# Altium project APC1_EPS.PrjPcb
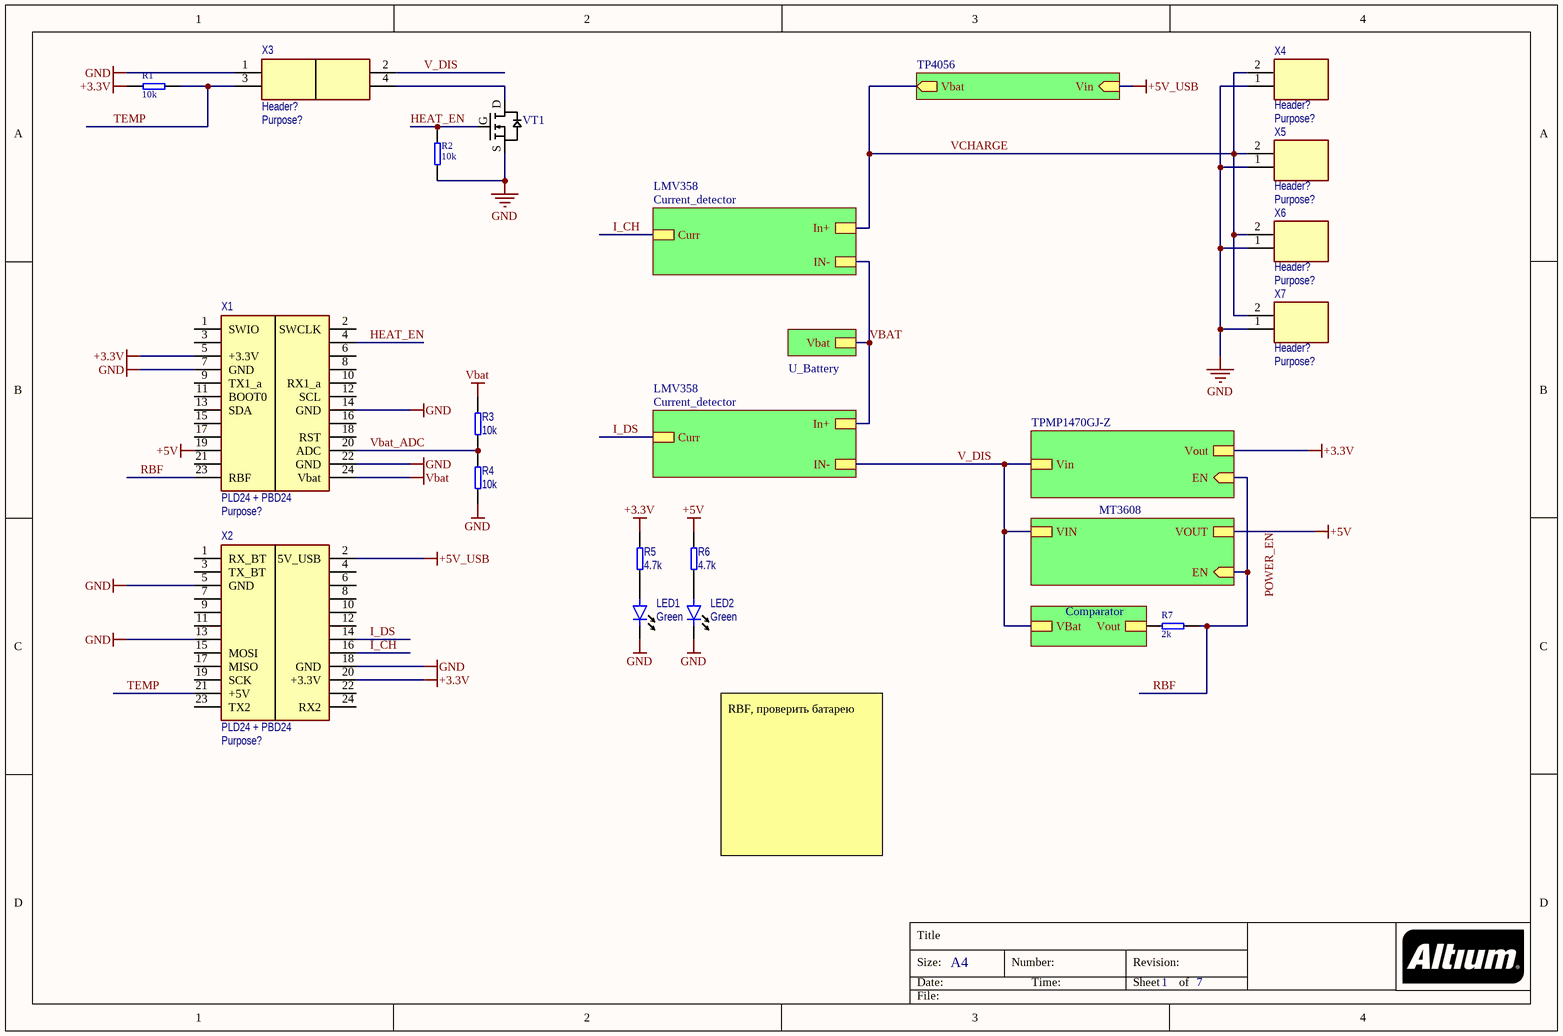
[diagram p0: APC1_EPS.SchDoc]
7 sheets, 73 parts. Net scope: hierarchical (ports join the sheet entries above them; power ports are global).
Board file: APC1_EPS.PcbDoc
Sheets:
  APC1_EPS.SchDoc
    U_Battery = Battery.SchDoc
    TP4056 = TP4056.SchDoc
    TPMP1470GJ-Z = TPMP1470GJ-Z.SchDoc
    Comparator = Comparator.SchDoc
    LMV358 = Current_detector.SchDoc
    LMV358 = Current_detector.SchDoc
    MT3608 = MT3608.SchDoc

## Sheet APC1_EPS.SchDoc: =GlobalProjectName
size A4; ApprovedBy: Утвердил; CheckedBy: Проверил; Author: Разработал; SheetNumber: 1; SheetTotal: 7; PageSetup: Record=PageOptions|CenterHorizontal=True|CenterVertical=True|PrintScale=1.00|XCorrection=1.00|YCorrection=1.00|PrintKind=1|BorderSize=5000000|LeftOffset=0|BottomOffset=0|Orientation=2|PaperLength=1000|PaperWidth=1000|Scale=100|PaperSource=15|PrintQuality=1200|MediaType=1|DitherType=10|PaperKind=A3|PrintScaleMode=1; Weight: -; ScaleFactor: -; NormInspection: Норм.Контр.

### Parts
LED1  value Green  [LED 0603]
LED2  value Green  [LED 0603]
R1  value 10k  [RES 0402]
R2  value 10k  [RES 0402]
R3  value 10k  [RES 0402]
R4  value 10k  [RES 0402]
R5  value 4.7k  [RES 0402]
R6  value 4.7k  [RES 0402]
R7  value 2k  [RES 0402]
VT1  AO3400A  [SOT23-3]  (value not drawn)
X1  PLD24 + PBD24  Purpose: Purpose?  [PICOSAT_CNN]
X2  PLD24 + PBD24  Purpose: Purpose?  [PICOSAT_CNN]
X3  Header?  Purpose: Purpose?  [PBD-4-2.54]
X4  Header?  Purpose: Purpose?  [ZH-2]
X5  Header?  Purpose: Purpose?  [ZH-2]
X6  Header?  Purpose: Purpose?  [ZH-2]
X7  Header?  Purpose: Purpose?  [ZH-2]

### Sub-sheets
Comparator = Comparator.SchDoc: VBat, Vout
LMV358 = Current_detector: In+, IN-, Curr
LMV358 = Current_detector: In+, IN-, Curr
MT3608 = MT3608.SchDoc: VIN, VOUT, EN (in)
TP4056 = TP4056.SchDoc: Vin (in), Vbat (out)
TPMP1470GJ-Z = TPMP1470GJ-Z.SchDoc: Vin, Vout, EN (in)
U_Battery = Battery.SchDoc: Vbat

### Nets
+3.3V: R1.1 R5.2 X1.5(+3.3V) X2.20(+3.3V) ; sheet TPMP1470GJ-Z/Vout
+5V_USB: X2.2(5V_USB) ; sheet TP4056/Vin
GND: LED1.2(Cathode) LED2.2(Cathode) R2.1 R4.1 VT1.S1 X1.7(GND) X1.14(GND) X1.22(GND) X2.5(GND) X2.13 X2.18(GND) X3.1 X4.1 X5.1 X6.1 X7.1
POWER_EN: R6.2 X1.19 ; sheet MT3608/VOUT  [also labelled +5V]
VBAT: R3.2 X1.24(Vbat) ; sheet U_Battery/Vbat, sheet LMV358/In+, sheet LMV358/IN-
HEAT_EN: R2.2 VT1.G2 X1.4
I_CH: X2.16 ; sheet LMV358/Curr
I_DS: X2.14 ; sheet LMV358/Curr
RBF: R7.2 X1.23(RBF) ; sheet TPMP1470GJ-Z/EN, sheet MT3608/EN
TEMP: R1.2 X2.21(+5V) X3.3
V_DIS: X3.2 ; sheet TPMP1470GJ-Z/Vin, sheet Comparator/VBat, sheet LMV358/IN-, sheet MT3608/VIN
Vbat_ADC: R3.1 R4.2 X1.20(ADC)
VCHARGE: X4.2 X5.2 X6.2 X7.2 ; sheet TP4056/Vbat, sheet LMV358/In+
NetLED1_1: LED1.1(Anode) R5.1
NetLED2_1: LED2.1(Anode) R6.1
NetR7_1: R7.1 ; sheet Comparator/Vout
NetVT1_D6: VT1.D6 X3.4

Not connected (* = marked no-connect by the designer): X1 1(SWIO) 2(SWCLK) 3 6 8 9(TX1_a) 10(RX1_a) 11(BOOT0) 12(SCL) 13(SDA) 15 16 17 18(RST) 21; X2 1(RX_BT) 3(TX_BT) 4 6 7 8 9 10 11 12 15(MOSI) 17(MISO) 19(SCK) 22 23(TX2) 24(RX2)

### Notes on the sheet
- RBF, проверить батарею
- Title
- Size:
- Date:
- A4
- Number:
- Time:
- Revision:
- Sheet
- of
- File:
- (in symbol !Generic N MOSFET) D; G; S

### Library data of the parts
LED1 LED2 = LED: Light Emittering Diode; IsSMT: NoSMT
R1-R7 = !Resistor: Resistor; IsSMT: NoSMT
VT1 = !Generic N MOSFET: generic N mosfet; pin to pad: D6>3 G2>1 S1>2; IsSMT: NoSMT
X1 X2 = Header 2x12: 10x2 header; IsSMT: NoSMT
X3 = Header 2x2: 2x2 header; IsSMT: NoSMT
X4-X7 = Header 1x2: 2x1 header; isSMT: NoSMT

## Sheet Battery.SchDoc: =GlobalProjectName
size 209 x 297 mm; ApprovedBy: Утвердил; CheckedBy: Проверил; Author: Разработал; SheetNumber: 2; SheetTotal: 7; PageSetup: Record=PageOptions|CenterHorizontal=True|CenterVertical=True|PrintScale=1.00|XCorrection=1.00|YCorrection=1.00|PrintKind=1|BorderSize=5000000|LeftOffset=0|BottomOffset=0|Orientation=2|PaperLength=1000|PaperWidth=1000|Scale=100|PaperSource=15|PrintQuality=1200|MediaType=1|DitherType=10|PaperKind=A3|PrintScaleMode=1; Weight: -; ScaleFactor: -; NormInspection: Норм.Контр.
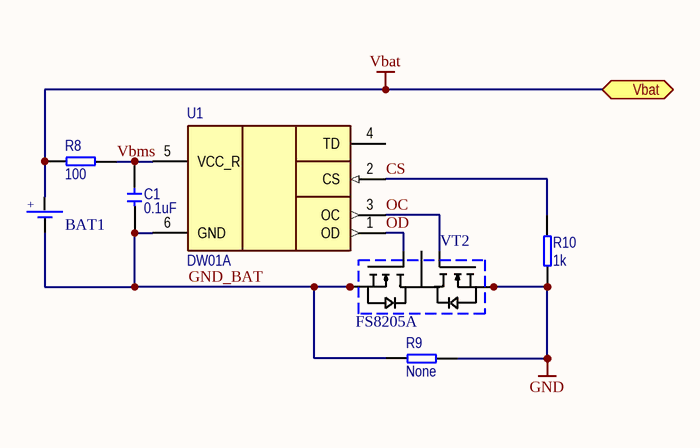
[diagram p1: Battery.SchDoc]

### Parts
BAT1  18350+clipses  [BAT_18350_CLIPS]  (value not drawn)
C1  value 0.1uF  [CERCAP 0402]
R8  value 100  [RES 0402]
R9  value None  [RES 0603]  (no BOM)
R10  value 1k  [RES 0402]
U1  DW01A  [SOT23-6]
VT2  FS8205A  [TSSOP-8]

### Ports
Vbat (bidir)

### Nets
GND: R9.1 R10.1 VT2.6 VT2.7
VBAT: BAT1.A R8.1 ; port Vbat
CS: R10.2 U1.2(CS)
GND_BAT: BAT1.K C1.1 R9.2 U1.6(GND) VT2.2 VT2.3
OC: U1.3(OC) VT2.5
OD: U1.1(OD) VT2.4
Vbms: C1.2 R8.2 U1.5(VCC_R)
NetVT2_1: VT2.1 VT2.8

Not connected (* = marked no-connect by the designer): U1 4(TD)

### Notes on the sheet
- Подп. и дата
- Инв. № дубл.
- Взам. инв. №
- Инв. № подл.
- Изм.
- Лист
- № докум.
- Подп.
- Дата
- Форма 2а ГОСТ 2.104-2006
- Копировал
- Формат А4
- (in symbol !Battery) +

### Library data of the parts
BAT1 = !Battery: generic battery
C1 = !Capacitor: Capacitor; IsSMT: NoSMT; Voltage: 10V; Diel: X7R
R8-R10 = !Resistor: Resistor; IsSMT: NoSMT
U1 = DW01A: BMS
VT2 = FS8205A: double N-ch; IsSMT: NoSMT

## Sheet TP4056.SchDoc: =GlobalProjectName
size 209 x 297 mm; ApprovedBy: Утвердил; CheckedBy: Проверил; Author: Разработал; SheetNumber: 3; SheetTotal: 7; PageSetup: Record=PageOptions|CenterHorizontal=True|CenterVertical=True|PrintScale=1.00|XCorrection=1.00|YCorrection=1.00|PrintKind=1|BorderSize=5000000|LeftOffset=0|BottomOffset=0|Orientation=2|PaperLength=1000|PaperWidth=1000|Scale=100|PaperSource=15|PrintQuality=1200|MediaType=1|DitherType=10|PaperKind=A3|PrintScaleMode=1; Weight: -; ScaleFactor: -; NormInspection: Норм.Контр.
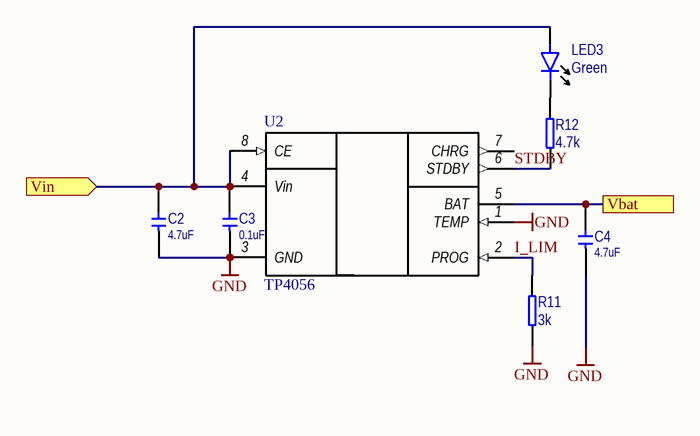
[diagram p2: TP4056.SchDoc]

### Parts
C2  value 4.7uF  [CERCAP 0805]
C3  value 0.1uF  [CERCAP 0402]
C4  value 4.7uF  [CERCAP 0805]
LED3  value Green  [LED 0603]
R11  value 3k  [RES 0402]
R12  value 4.7k  [RES 0402]
U2  TP4056  [SO-8]

### Ports
Vbat, Vin (in)

### Nets
+5V_USB: C2.2 C3.2 LED3.1(Anode) U2.4(Vin) U2.8(CE) ; port Vin
GND: C2.1 C3.1 C4.1 R11.1 U2.1(TEMP) U2.3(GND)
I_LIM: R11.2 U2.2(PROG)
STDBY: R12.1 U2.6(STDBY)
VCHARGE: C4.2 U2.5(BAT) ; port Vbat
NetLED3_2: LED3.2(Cathode) R12.2

Not connected (* = marked no-connect by the designer): U2 7(CHRG)

### Notes on the sheet
- Подп. и дата
- Инв. № дубл.
- Взам. инв. №
- Инв. № подл.
- Изм.
- Лист
- № докум.
- Подп.
- Дата
- Форма 2а ГОСТ 2.104-2006
- Копировал
- Формат А4

### Library data of the parts
C2-C4 = !Capacitor: as C1 on sheet Battery
LED3 = LED: Light Emittering Diode; IsSMT: NoSMT
R11 R12 = !Resistor: Resistor; IsSMT: NoSMT
U2 = TP4056: Charger lin; Order: TP4056

## Sheet TPMP1470GJ-Z.SchDoc
size A4; SheetNumber: 4; SheetTotal: 7
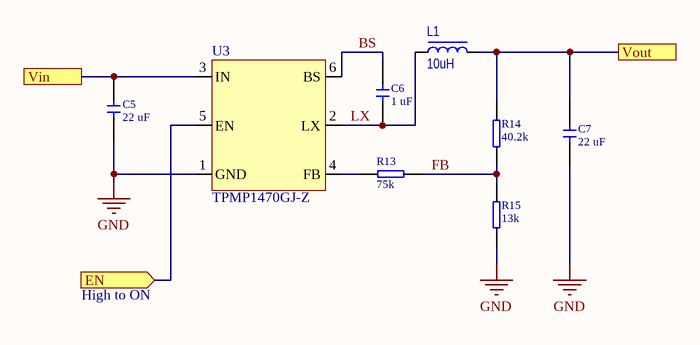
[diagram p3: TPMP1470GJ-Z.SchDoc]

### Parts
C5  value 22 uF  [CERCAP 0805]
C6  value 1 uF  [CERCAP 0603]
C7  value 22 uF  [CERCAP 0805]
L1  value 10uH  [FXL0420]
R13  value 75k  [RES 0402]
R14  value 40.2k  [RES 0402]
R15  value 13k  [RES 0402]
U3  TPMP1470GJ-Z  [SOT23-6]

### Ports
EN (in), Vin, Vout

### Nets
+3.3V: C7.2 L1.2 R14.2 ; port Vout
GND: C5.1 C7.1 R15.1 U3.1(GND)
BS: C6.2 U3.6(BS)
FB: R13.2 R14.1 R15.2
LX: C6.1 L1.1 U3.2(LX)
RBF: U3.5(EN) ; port EN
V_DIS: C5.2 U3.3(IN) ; port Vin
NetR13_1: R13.1 U3.4(FB)

### Notes on the sheet
- High to ON

### Library data of the parts
C5-C7 = !Capacitor: Capacitor; IsSMT: NoSMT; Diel: X7R; Voltage: *
L1 = Inductor: IsSMT: NoSMT
R13-R15 = !Resistor: Resistor; IsSMT: NoSMT

## Sheet Comparator.SchDoc
size A4; SheetNumber: 5; SheetTotal: 7
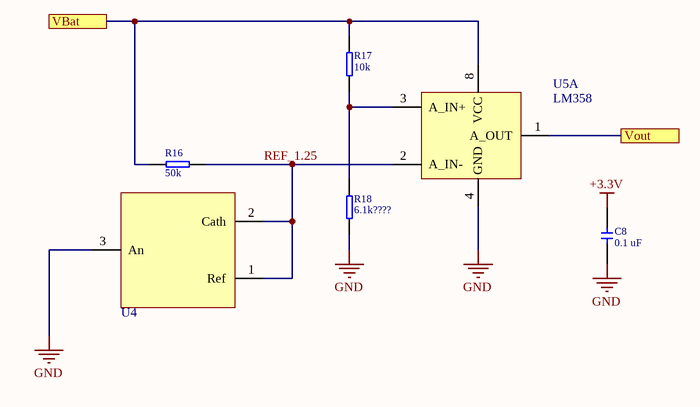
[diagram p4: Comparator.SchDoc]

### Parts
C8  value 0.1 uF  [CERCAP 0402]
R16  value 50k  [RES 0402]
R17  value 10k  [RES 0402]
R18  value 6.1k????  [RES 0402]
U4  Voltage_Ref  [SOT23-3]  (value not drawn)
U5  LM358  [SO-8]  (part A of 2)

### Ports
VBat, Vout

### Nets
+3.3V: C8.2
GND: C8.1 R18.1 U4.3(An) U5.4(GND)
REF_1.25: R16.2 U4.1(Ref) U4.2(Cath) U5.2(A_IN-)
V_DIS: R16.1 R17.1 U5.8(VCC) ; port VBat
NetR7_1: U5.1(A_OUT) ; port Vout
NetR17_2: R17.2 R18.2 U5.3(A_IN+)

### Library data of the parts
C8 = !Capacitor: Capacitor; IsSMT: NoSMT; Diel: X7R; Voltage: *
R16-R18 = !Resistor: Resistor; IsSMT: NoSMT
U5 = DualOpAmp: Operational amplifier

## Sheet Current_detector.SchDoc
size A4; SheetNumber: 6; SheetTotal: 7
Used 2 times, as channels LMV358, LMV358. Parts and nets are listed once, with the designators drawn on the sheet.
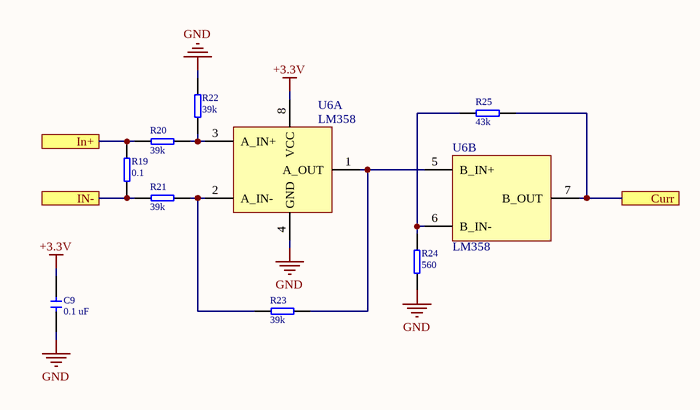
[diagram p5: Current_detector.SchDoc]

### Parts
C9  value 0.1 uF  [CERCAP 0402]
R19  value 0.1  [RES 1206]
R20  value 39k  [RES 0402]
R21  value 39k  [RES 0402]
R22  value 39k  [RES 0402]
R23  value 39k  [RES 0402]
R24  value 560  [RES 0402]
R25  value 43k  [RES 0402]
U6  LM358  [SO-8]  (parts A,B of 2)

### Ports
Curr, In+, IN-

### Nets
+3.3V: C9.2 U6.8(VCC)
GND: C9.1 R22.2 R24.1 U6.4(GND)
Curr: R25.2 U6.7(B_OUT) ; port Curr
In+: R19.2 R20.1 ; port In+
IN-: R19.1 R21.1 ; port IN-
NetR20_2: R20.2 R22.1 U6.3(A_IN+)
NetR21_2: R21.2 R23.1 U6.2(A_IN-)
NetR23_2: R23.2 U6.1(A_OUT) U6.5(B_IN+)
NetR24_2: R24.2 R25.1 U6.6(B_IN-)

### Channels
LMV358: designators end in _LMV358#1; ports Curr=I_DS In+=VBAT IN-=V_DIS
LMV358: designators end in _LMV358#2; ports Curr=I_CH In+=VCHARGE IN-=VBAT

### Library data of the parts
C9 = !Capacitor: Capacitor; IsSMT: NoSMT; Diel: X7R; Voltage: *
R19-R25 = !Resistor: Resistor; IsSMT: NoSMT
U6 = DualOpAmp: Operational amplifier

## Sheet MT3608.SchDoc
size A4; SheetNumber: 7; SheetTotal: 7
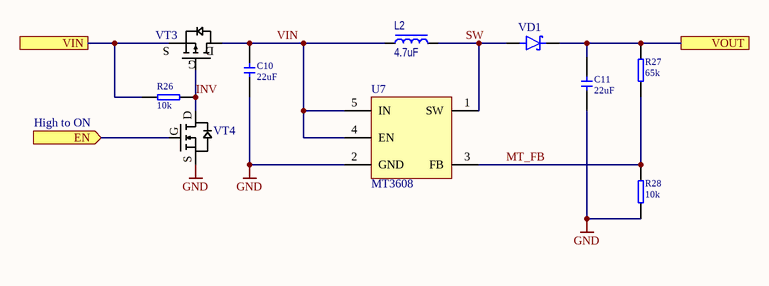
[diagram p6: MT3608.SchDoc]

### Parts
C10  value 22uF  [CERCAP 0805]
C11  value 22uF  [CERCAP 0805]
L2  value 4.7uF  [FXL0420]
R26  value 10k  [RES 0402]
R27  value 65k  [RES 0402]
R28  value 10k  [RES 0402]
U7  MT3608  [SOT23-6]
VD1  (no value)  [SOD-123]
VT3  BSS84  [SOT23-3]  (value not drawn)
VT4  2N7002  [SOT23-3]  (value not drawn)

### Ports
EN (in), VIN, VOUT

### Nets
GND: C10.1 C11.1 R28.1 U7.2(GND) VT4.S1
POWER_EN: C11.2 R27.2 VD1.C(Cathode) ; port VOUT
INV: R26.2 VT3.G2 VT4.D6
MT_FB: R27.1 R28.2 U7.3(FB)
RBF: VT4.G2 ; port EN
SW: L2.2 U7.1(SW) VD1.A(Anode)
V_DIS: R26.1 VT3.S1 ; port VIN
VIN: C10.2 L2.1 U7.4(EN) U7.5(IN) VT3.D1

### Notes on the sheet
- High to ON
- (in symbol !Generic N MOSFET) D; G; S
- (in symbol !Generic P MOSFET) S; D; G

### Library data of the parts
C10 C11 = !Capacitor: Capacitor; IsSMT: NoSMT; Diel: X7R; Voltage: *
L2 = Inductor: IsSMT: NoSMT
R26-R28 = !Resistor: Resistor; IsSMT: NoSMT
U7 = MT3608: Integrated Circuit; Manufacturer_Name: Aerosemi; Datasheet Link: https://www.olimex.com/Products/Breadboarding/BB-PWR-3608/resources/MT3608.pdf; Height: 1.45mm; Manufacturer_Part_Number: MT3608
VD1 = DiodeS: Diode Shottky; IsSMT: NoSMT
VT3 = !Generic P MOSFET: generic P mosfet; pin to pad: D1>3 G2>1 S1>2; IsSMT: NoSMT
VT4 = !Generic N MOSFET: generic N mosfet; pin to pad: D6>3 G2>1 S1>2; IsSMT: NoSMT

## Nets that join several sheets
+3.3V: APC1_EPS (R1.1 R5.2 X1.5 X2.20), TPMP1470GJ-Z (C7.2 L1.2 R14.2), Comparator (C8.2), LMV358 (C9_LMV358#1.2 U6_LMV358#1.8), LMV358 (C9_LMV358#2.2 U6_LMV358#2.8)
+5V_USB: APC1_EPS (X2.2), TP4056 (5 pins)
GND: APC1_EPS (16 pins), Battery (R9.1 R10.1 VT2.6 VT2.7), TP4056 (6 pins), TPMP1470GJ-Z (C5.1 C7.1 R15.1 U3.1), Comparator (C8.1 R18.1 U4.3 U5.4), LMV358 (C9_LMV358#1.1 R22_LMV358#1.2 R24_LMV358#1.1 U6_LMV358#1.4), LMV358 (C9_LMV358#2.1 R22_LMV358#2.2 R24_LMV358#2.1 U6_LMV358#2.4), MT3608 (5 pins)
POWER_EN: APC1_EPS (R6.2 X1.19), MT3608 (C11.2 R27.2 VD1.C)
VBAT: APC1_EPS (R3.2 X1.24), Battery (BAT1.A R8.1), LMV358 (R19_LMV358#1.2 R20_LMV358#1.1), LMV358 (R19_LMV358#2.1 R21_LMV358#2.1)
I_CH: APC1_EPS (X2.16), LMV358 (R25_LMV358#2.2 U6_LMV358#2.7)
I_DS: APC1_EPS (X2.14), LMV358 (R25_LMV358#1.2 U6_LMV358#1.7)
NetR7_1: APC1_EPS (R7.1), Comparator (U5.1)
RBF: APC1_EPS (R7.2 X1.23), TPMP1470GJ-Z (U3.5), MT3608 (VT4.G2)
V_DIS: APC1_EPS (X3.2), TPMP1470GJ-Z (C5.2 U3.3), Comparator (R16.1 R17.1 U5.8), LMV358 (R19_LMV358#1.1 R21_LMV358#1.1), MT3608 (R26.1 VT3.S1)
VCHARGE: APC1_EPS (X4.2 X5.2 X6.2 X7.2), TP4056 (C4.2 U2.5), LMV358 (R19_LMV358#2.2 R20_LMV358#2.1)